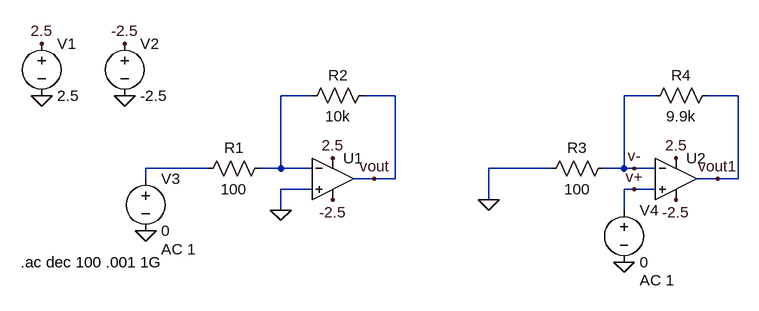
[diagram p0: schematic basic_feedback_amps.asc]
basic_feedback_amps.asc, the LTspice schematic file:
Version 4
SHEET 1 1396 680
WIRE 208 32 160 32
WIRE 336 32 288 32
WIRE 736 32 688 32
WIRE 864 32 816 32
WIRE 48 144 -48 144
WIRE 160 144 160 32
WIRE 160 144 128 144
WIRE 208 144 160 144
WIRE 576 144 480 144
WIRE 688 144 688 32
WIRE 688 144 656 144
WIRE 704 144 688 144
WIRE 736 144 704 144
WIRE -48 160 -48 144
WIRE 304 160 272 160
WIRE 336 160 336 32
WIRE 336 160 304 160
WIRE 832 160 800 160
WIRE 864 160 864 32
WIRE 864 160 832 160
WIRE 208 176 160 176
WIRE 704 176 688 176
WIRE 736 176 704 176
WIRE 480 192 480 144
WIRE 160 208 160 176
WIRE 688 208 688 176
FLAG -80 32 0
FLAG -208 32 0
FLAG -208 -48 2.5
FLAG -80 -48 -2.5
FLAG -48 240 0
FLAG 160 208 0
FLAG 240 128 2.5
FLAG 240 192 -2.5
FLAG 304 160 vout
FLAG 688 288 0
FLAG 768 128 2.5
FLAG 768 192 -2.5
FLAG 832 160 vout1
FLAG 480 192 0
FLAG 704 144 v-
FLAG 704 176 v+
DATAFLAG 336 112 ""
SYMBOL Opamps\\UniversalOpamp2 240 160 R0
SYMATTR InstName U1
SYMATTR Value2 Avol=1Meg GBW=1Meg Slew=10Meg
SYMBOL voltage -208 -64 R0
WINDOW 123 0 0 Left 0
WINDOW 39 0 0 Left 0
SYMATTR InstName V1
SYMATTR Value 2.5
SYMBOL voltage -80 -64 R0
WINDOW 123 0 0 Left 0
WINDOW 39 0 0 Left 0
SYMATTR InstName V2
SYMATTR Value -2.5
SYMBOL res 144 128 R90
WINDOW 0 0 56 VBottom 2
WINDOW 3 32 56 VTop 2
SYMATTR InstName R1
SYMATTR Value 100
SYMBOL res 304 16 R90
WINDOW 0 0 56 VBottom 2
WINDOW 3 32 56 VTop 2
SYMATTR InstName R2
SYMATTR Value 10k
SYMBOL voltage -48 144 R0
WINDOW 123 24 124 Left 2
WINDOW 39 0 0 Left 0
SYMATTR Value2 AC 1
SYMATTR InstName V3
SYMATTR Value 0
SYMBOL Opamps\\UniversalOpamp2 768 160 R0
SYMATTR InstName U2
SYMATTR Value2 Avol=1Meg GBW=1Meg Slew=10Meg
SYMBOL res 672 128 R90
WINDOW 0 0 56 VBottom 2
WINDOW 3 32 56 VTop 2
SYMATTR InstName R3
SYMATTR Value 100
SYMBOL res 832 16 R90
WINDOW 0 0 56 VBottom 2
WINDOW 3 32 56 VTop 2
SYMATTR InstName R4
SYMATTR Value 9.9k
SYMBOL voltage 688 192 R0
WINDOW 123 24 124 Left 2
WINDOW 39 0 0 Left 0
SYMATTR Value2 AC 1
SYMATTR InstName V4
SYMATTR Value 0
TEXT -240 288 Left 2 !.ac dec 100 .001 1G

The netlist it stands for:
* basic_feedback_amps.asc
XU1 0 N001 2.5 -2.5 vout level.2 Avol=1Meg GBW=1Meg Slew=10Meg ilimit=25m rail=0 Vos=0 phimargin=45 en=0 enk=0 in=0 ink=0 Rin=500Meg  ; pins IN+ IN- V+ V- OUT
V1 2.5 0 2.5
V2 -2.5 0 -2.5
R1 N001 N002 100
R2 vout N001 10k
V3 N002 0 0 AC 1
XU2 v+ v- 2.5 -2.5 vout1 level.2 Avol=1Meg GBW=1Meg Slew=10Meg ilimit=25m rail=0 Vos=0 phimargin=45 en=0 enk=0 in=0 ink=0 Rin=500Meg  ; pins IN+ IN- V+ V- OUT
R3 v- 0 100
R4 vout1 v- 9.9k
V4 v+ 0 0 AC 1
.ac dec 100 .001 1G
.lib UniversalOpamps2.sub
.backanno
.end